# Altium project recepeurs.PrjPCB
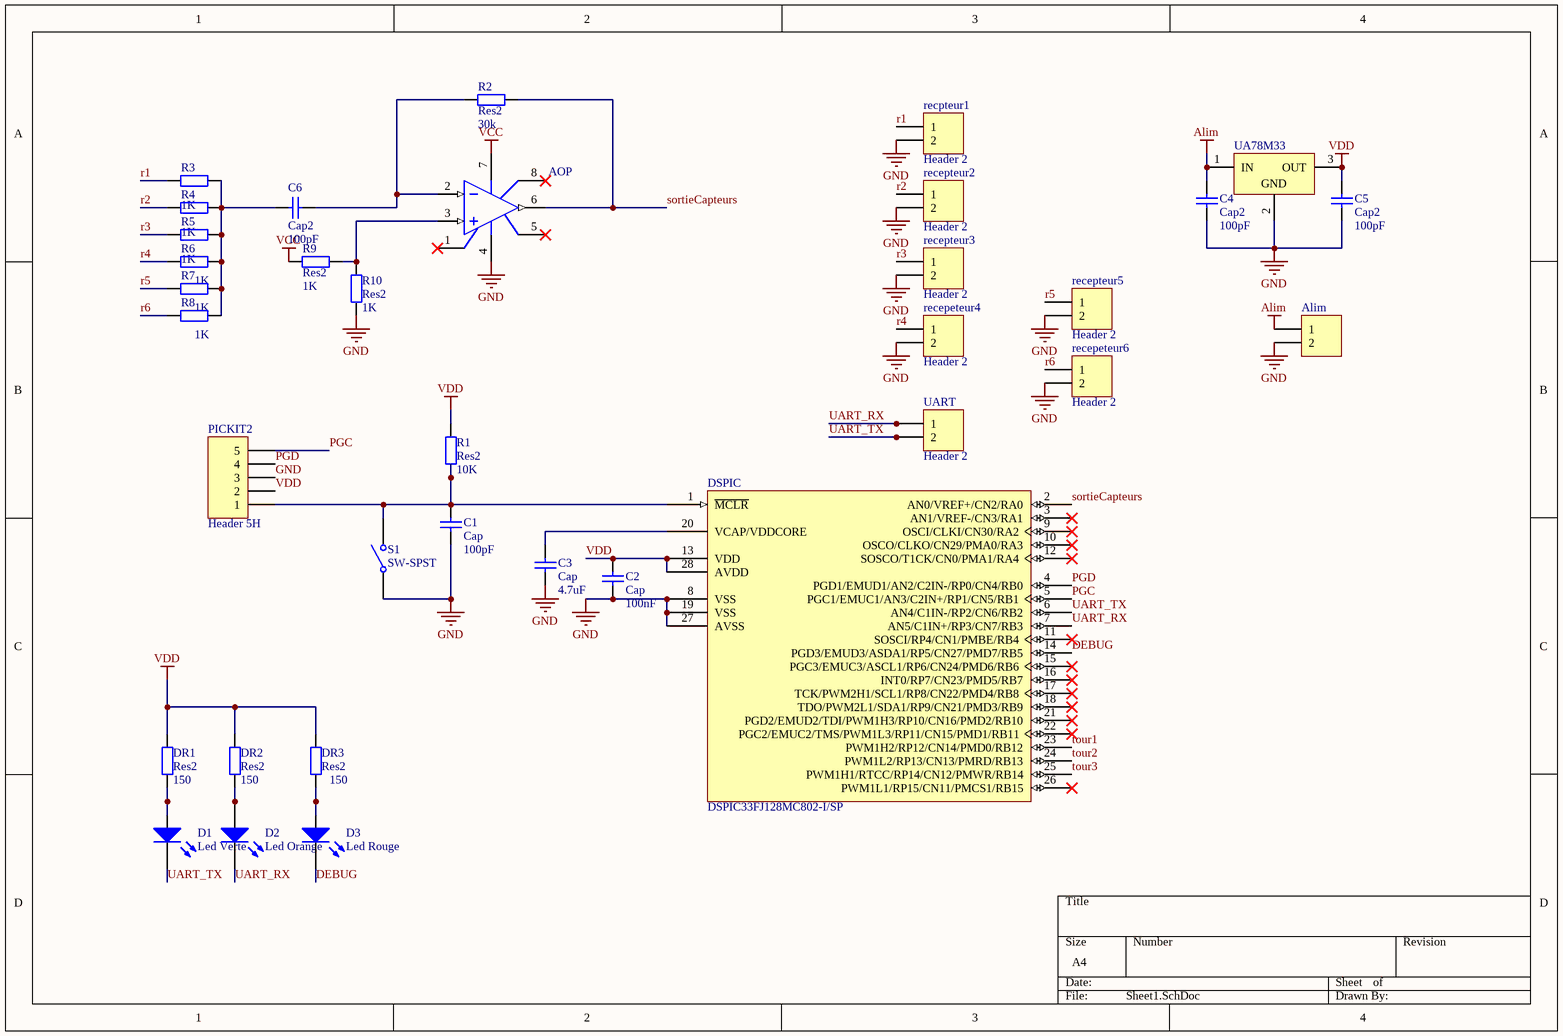
[diagram p0: Sheet1.SchDoc]
1 sheet, 35 parts. Net scope: global (net labels, ports and power ports of the same name join across sheets).
Board file: PCBrecepteurs.PcbDoc

## Sheet Sheet1.SchDoc
size A4

### Parts
Alim  Header 2  [HDR1X2]  (value not drawn)
AOP  TL081CN  [DIP8]  (value not drawn)
C1  Cap  value 100pF  [RAD-0.3]
C2  Cap  value 100nF  [RAD-0.3]
C3  Cap  value 4.7uF  [RAD-0.3]
C4  Cap2  value 100pF  [CAPA2]
C5  Cap2  value 100pF  [CAPA2]
C6  Cap2  value 100pF  [CAPA2]
D1  Led Verte  [LED]
D2  Led Orange  [LED]
D3  Led Rouge  [LED]
DR1  Res2  value 150  [AXIAL-0.4]
DR2  Res2  value 150  [AXIAL-0.4]
DR3  Res2  value 150  [AXIAL-0.4]
DSPIC  DSPIC33FJ128MC802-I/SP  [SPDIP300-SP28]
PICKIT2  Header 5H  [HDR1X5]
R1  Res2  value 10K  [AXIAL-0.4]
R2  Res2  value 30k  [res5_1/4W]
R3  value 1K  [res5_1/4W]  (hidden comment: Res2)
R4  value 1K  [res5_1/4W]  (hidden comment: Res2)
R5  value 1K  [res5_1/4W]  (hidden comment: Res2)
R6  value 1K  [res5_1/4W]  (hidden comment: Res2)
R7  value 1K  [res5_1/4W]  (hidden comment: Res2)
R8  value 1K  [res5_1/4W]  (hidden comment: Res2)
R9  Res2  value 1K  [res5_1/4W]
R10  Res2  value 1K  [res5_1/4W]
recepeteur4  Header 2  [HDR1X2]
recepeteur6  Header 2  [HDR1X2]
recepteur2  Header 2  [HDR1X2]
recepteur3  Header 2  [HDR1X2]
recepteur5  Header 2  [HDR1X2]
recpteur1  Header 2  [HDR1X2]
S1  SW-SPST  [SPST-2]
UA78M33  LM7805CT  [TO220]  (value not drawn)
UART  Header 2  [HDR1X2]

### Nets
Alim: Alim.1 C4.2 UA78M33.1(IN)
GND: Alim.2 AOP.4(V-) C1.1 C2.1 C3.1 C4.1 C5.1 DSPIC.8(VSS) DSPIC.19(VSS) DSPIC.27(AVSS) PICKIT2.3 R10.1 recepeteur4.2 recepeteur6.2 recepteur2.2 recepteur3.2 recepteur5.2 recpteur1.2 S1.1(COMMON) UA78M33.2(GND)
VCC: AOP.7(V+) R9.1
VDD: C2.2 C5.2 DR1.2 DR2.2 DR3.2 DSPIC.13(VDD) DSPIC.28(AVDD) PICKIT2.2 R1.2 UA78M33.3(OUT)
DEBUG: D3.2(K) DSPIC.14(PGD3/EMUD3/ASDA1/RP5/CN27/PMD7/RB5)
PGC: DSPIC.5(PGC1/EMUC1/AN3/C2IN+/RP1/CN5/RB1) PICKIT2.5
PGD: DSPIC.4(PGD1/EMUD1/AN2/C2IN-/RP0/CN4/RB0) PICKIT2.4
r1: R3.1 recpteur1.1
r2: R4.1 recepteur2.1
r3: R5.1 recepteur3.1
r4: R6.1 recepeteur4.1
r5: R7.1 recepteur5.1
r6: R8.1 recepeteur6.1
sortieCapteurs: AOP.6(OUT) DSPIC.2(AN0/VREF+/CN2/RA0) R2.2
tour1: DSPIC.23(PWM1H2/RP12/CN14/PMD0/RB12)
tour2: DSPIC.24(PWM1L2/RP13/CN13/PMRD/RB13)
tour3: DSPIC.25(PWM1H1/RTCC/RP14/CN12/PMWR/RB14)
UART_RX: D2.2(K) DSPIC.7(AN5/C1IN+/RP3/CN7/RB3) UART.1
UART_TX: D1.2(K) DSPIC.6(AN4/C1IN-/RP2/CN6/RB2) UART.2
NetAOP_2: AOP.2(IN-) C6.2 R2.1
NetAOP_3: AOP.3(IN+) R9.2 R10.2
NetC1_2: C1.2 DSPIC.1(~{MCLR}) PICKIT2.1 R1.1 S1.2(NO)
NetC3_2: C3.2 DSPIC.20(VCAP/VDDCORE)
NetC6_1: C6.1 R3.2 R4.2 R5.2 R6.2 R7.2 R8.2
NetD1_1: D1.1(A) DR1.1
NetD2_1: D2.1(A) DR2.1
NetD3_1: D3.1(A) DR3.1

Not connected (* = marked no-connect by the designer): AOP 1(OS_NULL)* 5(OS_NULL)* 8(NC)*; DSPIC 3(AN1/VREF-/CN3/RA1)* 9(OSCI/CLKI/CN30/RA2)* 10(OSCO/CLKO/CN29/PMA0/RA3)* 11(SOSCI/RP4/CN1/PMBE/RB4)* 12(SOSCO/T1CK/CN0/PMA1/RA4)* 15(PGC3/EMUC3/ASCL1/RP6/CN24/PMD6/RB6)* 16(INT0/RP7/CN23/PMD5/RB7)* 17(TCK/PWM2H1/SCL1/RP8/CN22/PMD4/RB8)* 18(TDO/PWM2L1/SDA1/RP9/CN21/PMD3/RB9)* 21(PGD2/EMUD2/TDI/PWM1H3/RP10/CN16/PMD2/RB10)* 22(PGC2/EMUC2/TMS/PWM1L3/RP11/CN15/PMD1/RB11)* 26(PWM1L1/RP15/CN11/PMCS1/RB15)*

### Library data of the parts
Alim recepeteur4 recepeteur6 recepteur2 recepteur3 recepteur5 recpteur1 UART = Header 2: Header, 2-Pin; LatestRevisionDate: 17-Jul-2002; LatestRevisionNote: Re-released for DXP Platform.; Publisher: Altium Limited
AOP = TL081CN: General-Purpose J-FET Single Operational Amplifier; Published: 24-Aug-2001; LatestRevisionDate: 06-Jun-2005; LatestRevisionNote: Stylized 3D Model Added.; DatasheetVersion: Dec-1998; PackageReference: DIP8; Publisher: Altium Limited; PackageDescription: DIP; 8 Leads; Row Spacing 7.62 mm; Pitch 2.54 mm; Code_JEDEC: MO-001-AN; ComponentLink1Description: Manufacturer Link; ComponentLink1URL: http://www.st.com/; ComponentLink2Description: Datasheet; ComponentLink2URL: http://www.st.com/stonline/products/literature/ds/2299/tl081.pdf
C1-C3 = Cap: Capacitor; Published: 8-Jun-2000; LatestRevisionDate: 17-Jul-2002; LatestRevisionNote: Re-released for DXP Platform.; PackageReference: RAD-0.3; Publisher: Altium Limited; PackageDescription: Radial Cap, Thru-Hole; 2 Leads; 0.3 in Pin Spacing
C4-C6 = Cap2: Capacitor; Published: 8-Jun-2000; LatestRevisionDate: 17-Jul-2002; LatestRevisionNote: Re-released for DXP Platform.; PackageReference: RAD-0.3; Publisher: Altium Limited
D1-D3 = Led: Published: 8-Jun-2000; LatestRevisionDate: 17-Jul-2002; LatestRevisionNote: Re-released for DXP Platform.; DatasheetDocument: 1998; PackageDocument: Aug-1999; PackageReference: DO-41; Publisher: Altium Limited; Code_JEDEC: DO-204-AL; ComponentLink1Description: Manufacturer Link; ComponentLink1URL: http://www.fairchildsemi.com/; ComponentLink2Description: Datasheet; ComponentLink2URL: http://www.fairchildsemi.com/ds/1N%2F1N4001.pdf
DR1-DR3 R1-R10 = Res2: Resistor; Published: 8-Jun-2000; LatestRevisionDate: 17-Jul-2002; LatestRevisionNote: Re-released for DXP Platform.; PackageReference: AXIAL-0.4; Publisher: Altium Limited
  DR1-DR3 R1: PackageDescription: Axial Device, Thru-Hole; 2 Leads; 0.4 in Pin Spacing
DSPIC = DSPIC33FJ128MC802-I/SP: High-Performance 16-bit Digital Signal Controller, 128 KB Flash, 16 KB RAM, 28-Pin SPDIP, Industrial Temperature; Published: 29-Jan-2009; DatasheetVersion: revB, Mar-2008; PackageVersion: revAW, Oct-2008; PackageReference: SPDIP300-SP28; Publisher: Altium Limited; PackageDescription: 28-Lead Skinny Plastic Dual In-Line (SP) - 300 mil Body [SPDIP]; ComponentLink1Description: Manufacturer Link; ComponentLink1URL: http://www.microchip.com; ComponentLink2Description: Datasheet; ComponentLink2URL: http://ww1.microchip.com/downloads/en/DeviceDoc/70291B.pdf; ComponentLink3Description: Packaging Specification; ComponentLink3URL: http://ww1.microchip.com/downloads/en/PackagingSpec/00049AW.pdf
PICKIT2 = Header 5H: Header, 5-Pin, Right Angle; LatestRevisionDate: 17-Jul-2002; LatestRevisionNote: Re-released for DXP Platform.; Publisher: Altium Limited
S1 = SW-SPST: Single-Pole, Single-Throw Switch; Published: 24-Mar-1999; LatestRevisionDate: 17-Jul-2002; LatestRevisionNote: Re-released for DXP Platform.; PackageReference: SPST-2; Publisher: Altium Limited; PackageDescription: Switch; 2 Leads
UA78M33 = LM7805CT: Series 3-Terminal Positive Regulator; Note: Tab is connected to GND; Published: 15-Apr-2002; DatasheetVersion: May-1999; PackageVersion: 1995; PackageReference: T03B; Publisher: Altium Limited; PackageDescription: TO, Thru-Hole, Vertical, Heatsink Mounted; 3 In-Line Leads; Pitch 2.54 mm; ComponentLink1Description: Manufacturer Link; ComponentLink1URL: http://www.national.com/; ComponentLink2Description: Datasheet; ComponentLink2URL: http://www.national.com/ds.cgi/LM/LM7512C.pdf; ComponentLink3Description: URL Link1; ComponentLink3URL: http://www.national.com/pf/LM/LM7805C.html